# EAGLE schematic ECE6780_Final_project_schematic v1 v2 (EAGLE 9.7.0)
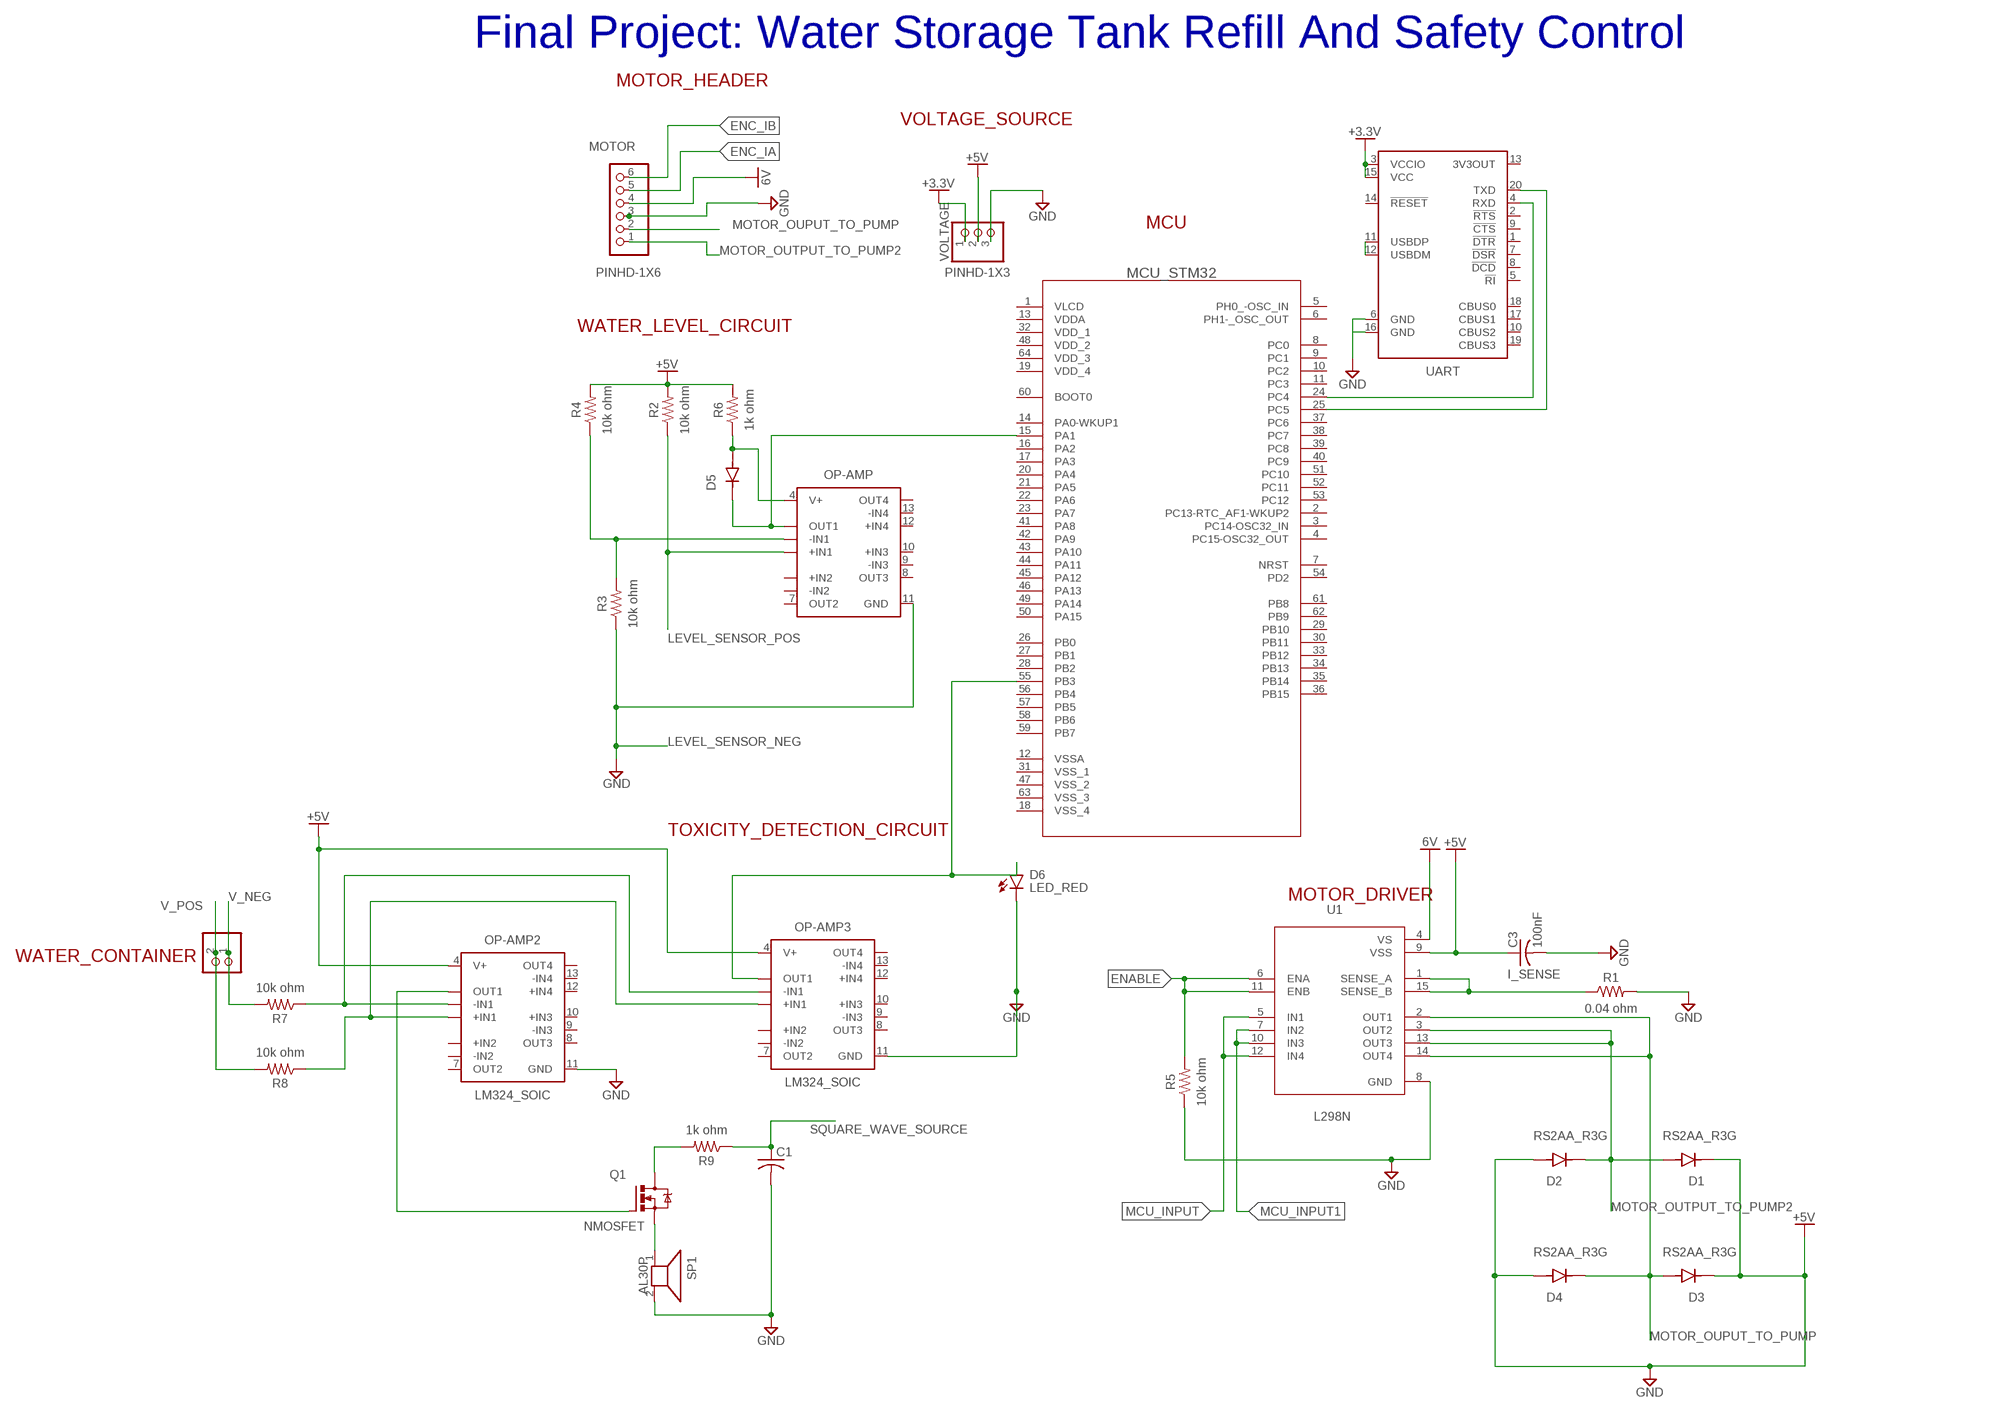
[diagram p0: schematic, sheet 1]

## Parts
C1  C-US_CHIP-0402(1005-METRIC)  [CAPC1005X60]
C3  100nF  C-US_CHIP-1206(3216-METRIC)  [CAPC3216X135]
D1  RS2AA_R3G  [DIOM4325X250N]
D2  RS2AA_R3G  [DIOM4325X250N]
D3  RS2AA_R3G  [DIOM4325X250N]
D4  RS2AA_R3G  [DIOM4325X250N]
D5  RS2AA_R3G  [DIOM4325X250N]
D6  LED_RED  CHIP-FLAT-R_0402  [LEDC1005X25N_FLAT-R]
MCU_STM32  STM32F100R6  STM32F100_QFP  [QFP50P1200X1200X160-64N]
MOTOR  PINHD-1X6  [1X06]
OP-AMP  LM324_SOIC  [SOIC127P600X175-14N]
OP-AMP2  LM324_SOIC  [SOIC127P600X175-14N]
OP-AMP3  LM324_SOIC  [SOIC127P600X175-14N]
Q1  NMOSFET  NMOSFET_TO220  [TO220BV]
R1  0.04 ohm  R-US_CHIP-1206(3216-METRIC)  [RESC3216X70]
R2  10k ohm  R-US_CHIP-1206(3216-METRIC)  [RESC3216X70]
R3  10k ohm  R-US_CHIP-1206(3216-METRIC)  [RESC3216X70]
R4  10k ohm  R-US_CHIP-1206(3216-METRIC)  [RESC3216X70]
R5  10k ohm  R-US_CHIP-1206(3216-METRIC)  [RESC3216X70]
R6  1k ohm  R-US_CHIP-1206(3216-METRIC)  [RESC3216X70]
R7  10k ohm  R-US_CHIP-1206(3216-METRIC)  [RESC3216X70]
R8  10k ohm  R-US_CHIP-1206(3216-METRIC)  [RESC3216X70]
R9  1k ohm  R-US_CHIP-1206(3216-METRIC)  [RESC3216X70]
SP1  AL30P  [AL30P]
U1  L298N  [TO127P2020X500X2100-15]
UART  FT231XS-X-_SSOP  [SOP63P599X175-20]
VOLTAGE  PINHD-1X3  [1X03]
WATER_CONTAINER  PINHD-1X2  [1X02]

## Nets
6V: MOTOR.4 U1.4(VS)
+3.3V: UART.3(VCCIO) UART.15(VCC) VOLTAGE.1
+5V: OP-AMP2.4(V+) OP-AMP3.4(V+)
ENABLE: R5.2 U1.6(ENA) U1.11(ENB)
ENC_IA: MOTOR.5
ENC_IB: MOTOR.6
GND: C1.2 C3.2 D1.C(K) D2.A D3.C(K) D4.A D6.C MOTOR.3 OP-AMP2.11(GND) OP-AMP3.11(GND) R1.2 R5.1 SP1.2 U1.8(GND) UART.6(GND) UART.16(GND) VOLTAGE.3 ; supply symbol labelled +5V
I_SENSE: R1.1 U1.1(SENSE_A) U1.15(SENSE_B)
LEVEL_SENSOR_NEG: OP-AMP.11(GND) R3.1 ; supply symbol labelled GND
LEVEL_SENSOR_POS: OP-AMP.2(-IN1) OP-AMP.3(+IN1) R2.1 R3.2 R4.1
MCU_INPUT: U1.5(IN1) U1.12(IN4)
MCU_INPUT1: U1.7(IN2) U1.10(IN3)
MOTOR_OUPUT_TO_PUMP: D3.A D4.C(K) MOTOR.2 U1.2(OUT1) U1.14(OUT4)
MOTOR_OUTPUT_TO_PUMP2: D1.A D2.C(K) MOTOR.1 U1.3(OUT2) U1.13(OUT3)
N$1: UART.11(USBDP) UART.12(USBDM)
N$2: MCU_STM32.25(PC5) UART.20(TXD)
N$3: MCU_STM32.24(PC4) UART.4(RXD)
N$4: OP-AMP2.2(-IN1) OP-AMP3.2(-IN1) R7.1
N$5: D5.A OP-AMP.4(V+) R6.1
N$6: D5.C(K) MCU_STM32.15(PA1) OP-AMP.1(OUT1)
N$7: OP-AMP2.3(+IN1) OP-AMP3.3(+IN1) R8.1
N$8: D6.A MCU_STM32.55(PB3) OP-AMP3.1(OUT1)
N$9: OP-AMP2.1(OUT1) Q1.G
N$10: Q1.S SP1.1
N$12: Q1.D R9.2
SQUARE_WAVE_SOURCE: C1.1 R9.1
V_NEG: R7.2 WATER_CONTAINER.1
V_POS: R8.2 WATER_CONTAINER.2
VN: C3.1 R2.2 R4.2 R6.2 U1.9(VSS) VOLTAGE.2 ; supply symbol labelled +5V
Unconnected: MCU_STM32.2(PC13-RTC_AF1-WKUP2) MCU_STM32.3(PC14-OSC32_IN) MCU_STM32.4(PC15-OSC32_OUT) MCU_STM32.5(PH0_-OSC_IN) MCU_STM32.6(PH1-_OSC_OUT) MCU_STM32.7(NRST) MCU_STM32.8(PC0) MCU_STM32.9(PC1) MCU_STM32.10(PC2) MCU_STM32.11(PC3) MCU_STM32.14(PA0-WKUP1) MCU_STM32.16(PA2) MCU_STM32.17(PA3) MCU_STM32.20(PA4) MCU_STM32.21(PA5) MCU_STM32.22(PA6) MCU_STM32.23(PA7) MCU_STM32.26(PB0) MCU_STM32.27(PB1) MCU_STM32.28(PB2) MCU_STM32.29(PB10) MCU_STM32.30(PB11) MCU_STM32.33(PB12) MCU_STM32.34(PB13) MCU_STM32.35(PB14) MCU_STM32.36(PB15) MCU_STM32.37(PC6) MCU_STM32.38(PC7) MCU_STM32.39(PC8) MCU_STM32.40(PC9) MCU_STM32.41(PA8) MCU_STM32.42(PA9) MCU_STM32.43(PA10) MCU_STM32.44(PA11) MCU_STM32.45(PA12) MCU_STM32.46(PA13) MCU_STM32.49(PA14) MCU_STM32.50(PA15) MCU_STM32.51(PC10) MCU_STM32.52(PC11) MCU_STM32.53(PC12) MCU_STM32.54(PD2) MCU_STM32.56(PB4) MCU_STM32.57(PB5) MCU_STM32.58(PB6) MCU_STM32.59(PB7) MCU_STM32.60(BOOT0) MCU_STM32.61(PB8) MCU_STM32.62(PB9) OP-AMP2.5(+IN2) OP-AMP2.6(-IN2) OP-AMP2.7(OUT2) OP-AMP2.8(OUT3) OP-AMP2.9(-IN3) OP-AMP2.10(+IN3) OP-AMP2.12(+IN4) OP-AMP2.13(-IN4) OP-AMP2.14(OUT4) OP-AMP3.5(+IN2) OP-AMP3.6(-IN2) OP-AMP3.7(OUT2) OP-AMP3.8(OUT3) OP-AMP3.9(-IN3) OP-AMP3.10(+IN3) OP-AMP3.12(+IN4) OP-AMP3.13(-IN4) OP-AMP3.14(OUT4) OP-AMP.5(+IN2) OP-AMP.6(-IN2) OP-AMP.7(OUT2) OP-AMP.8(OUT3) OP-AMP.9(-IN3) OP-AMP.10(+IN3) OP-AMP.12(+IN4) OP-AMP.13(-IN4) OP-AMP.14(OUT4) UART.1(!DTR) UART.2(!RTS) UART.5(!RI) UART.7(!DSR) UART.8(!DCD) UART.9(!CTS) UART.10(CBUS2) UART.13(3V3OUT) UART.14(!RESET) UART.17(CBUS1) UART.18(CBUS0) UART.19(CBUS3)

## Notes on the sheet
- Final Project: Water Storage Tank Refill And Safety Control
- MOTOR_HEADER
- VOLTAGE_SOURCE
- MCU
- WATER_LEVEL_CIRCUIT
- TOXICITY_DETECTION_CIRCUIT
- MOTOR_DRIVER

## Power pins joined to a net without a drawn wire
VDD_1: MCU_STM32.32(VDD_1)
VDD_2: MCU_STM32.48(VDD_2)
VDD_3: MCU_STM32.64(VDD_3)
VDD_4: MCU_STM32.19(VDD_4)
VDDA: MCU_STM32.13(VDDA)
VLCD: MCU_STM32.1(VLCD)
VSS_1: MCU_STM32.31(VSS_1)
VSS_2: MCU_STM32.47(VSS_2)
VSS_3: MCU_STM32.63(VSS_3)
VSS_4: MCU_STM32.18(VSS_4)
VSSA: MCU_STM32.12(VSSA)

## Library data of the parts
C1 C3 = Capacitor:C-US: Capacitor - ANSI; CATEGORY: Capacitor
D1-D5 = RS2AA_R3G:RS2AA_R3G; MANUFACTURER: Taiwan Semiconductor; MAXIMUM_PACKAGE_HEIGHT: 2.5 mm; PARTREV: L2102; STANDARD: IPC-7351B
D6 = LED:CHIP-FLAT-R; CATEGORY: LED; COLOR: RED; DESCRIPTION: CHIP LED FLAT; SUB-CATEGORY: CHIP; TYPE: FLAT_TOP
MCU_STM32 = IC_Embedded:STM32F100: Low & medium-density value line, advanced ARM®-based 32-bit MCU with 16 to 128 KB Flash, 12 timers, ADC, DAC & 8 comm interfaces Datasheet <https://www.st.com/resource/en/datasheet/stm32f100cb.pdf>; CATEGORY: IC_Embedded; MANUFACTURER: ST Microelectronics; MPN: STM32F100R6T6BRT; OPERATING_TEMP: -40 to 85 °C; PART_STATUS: Active; SUB-CATEGORY: Microcontroller; THERMALLOSS: 0.44W
MOTOR = Connector:PINHD-1X6: PIN HEADER; CATEGORY: Headers; DESCRIPTION: Header, Straight, 6 Position; MANUFACTURER: Generic; MPN: Generic; OPERATING_TEMPERATURE: Generic; PART_STATUS: Active; PITCH: 0.100" (2.54mm); ROHS_COMPLIANCE: Generic; SERIES: Generic; SUB-CATEGORY: Headers, Male Pins; TYPE: Board to Board or Cable, Unshrouded, Through Hole, Straight
OP-AMP OP-AMP2 OP-AMP3 = IC_Linear:LM324: Quad-Operational Amplifiers Reference Datasheet <https://www.ti.com/lit/ds/snosc16d/snosc16d.pdf>; CATEGORY: Operational Amplifiers; DESCRIPTION: Quad-Operational Amplifiers; MANUFACTURER: Generic; MPN: Generic; SERIES: LM324; SUB-CATEGORY: Amplifier ICs; TYPE: Op Amps - Operational Amplifiers
Q1 = Transistor:NMOSFET: N-Channel MOSFET - Generic; CATEGORY: Transistor; SUB-CATEGORY: MOSFET; TYPE: N-Channel
R1-R9 = Resistor:R-US: Resistor Fixed - ANSI; CATEGORY: Resistor; SUB-CATEGORY: Fixed
SP1 = buzzer:AL30P: SPEAKER Source: Buerklin; OC_FARNELL: unknown; OC_NEWARK: unknown
U1 = L298N:L298N: Dual Full Bridge Motor Driver 15-Pin(15+Tab) MULTIWATT V Tube; MANUFACTURER: STMicroelectronics; MAXIMUM_PACKAGE_HEIGHT: 5.0mm; STANDARD: IPC-7351B
UART = IC_Interface:FT231X*-X-?: FT231X USB TO FULL HANDSHAKE UART IC Datasheet <http://www.ftdichip.com/Support/Documents/DataSheets/ICs/DS_FT231X.pdf>; CATEGORY: IC_Interface; DESCRIPTION: USB TO FULL HANDSHAKE UART IC; MANUFACTURER: Future Technology Devices International Limited; MPN: FT231XS-x; OPERATING_TEMP: -40°C to 85°C; PART_STATUS: Active; ROHS_COMPLIANT: COMPLIANT; SERIES: FT231X; SUB-CATEGORY: USB to UART
VOLTAGE = Connector:PINHD-1X3: PIN HEADER; CATEGORY: Headers; DESCRIPTION: Header, Straight, 3 Position; MANUFACTURER: Generic; MPN: Generic; OPERATING_TEMPERATURE: Generic; PART_STATUS: Active; PITCH: 0.100" (2.54mm); ROHS_COMPLIANCE: Generic; SERIES: Generic; SUB-CATEGORY: Headers, Male Pins; TYPE: Board to Board or Cable, Unshrouded, Through Hole, Straight
WATER_CONTAINER = Connector:PINHD-1X2: PIN HEADER; CATEGORY: Headers; DESCRIPTION: Header, Straight, 2 Position; MANUFACTURER: Generic; MPN: Generic; OPERATING_TEMPERATURE: Generic; PART_STATUS: Active; PITCH: 0.100" (2.54mm); ROHS_COMPLIANCE: Generic; SERIES: Generic; SUB-CATEGORY: Headers, Male Pins; TYPE: Board to Board or Cable, Unshrouded, Through Hole, Straight